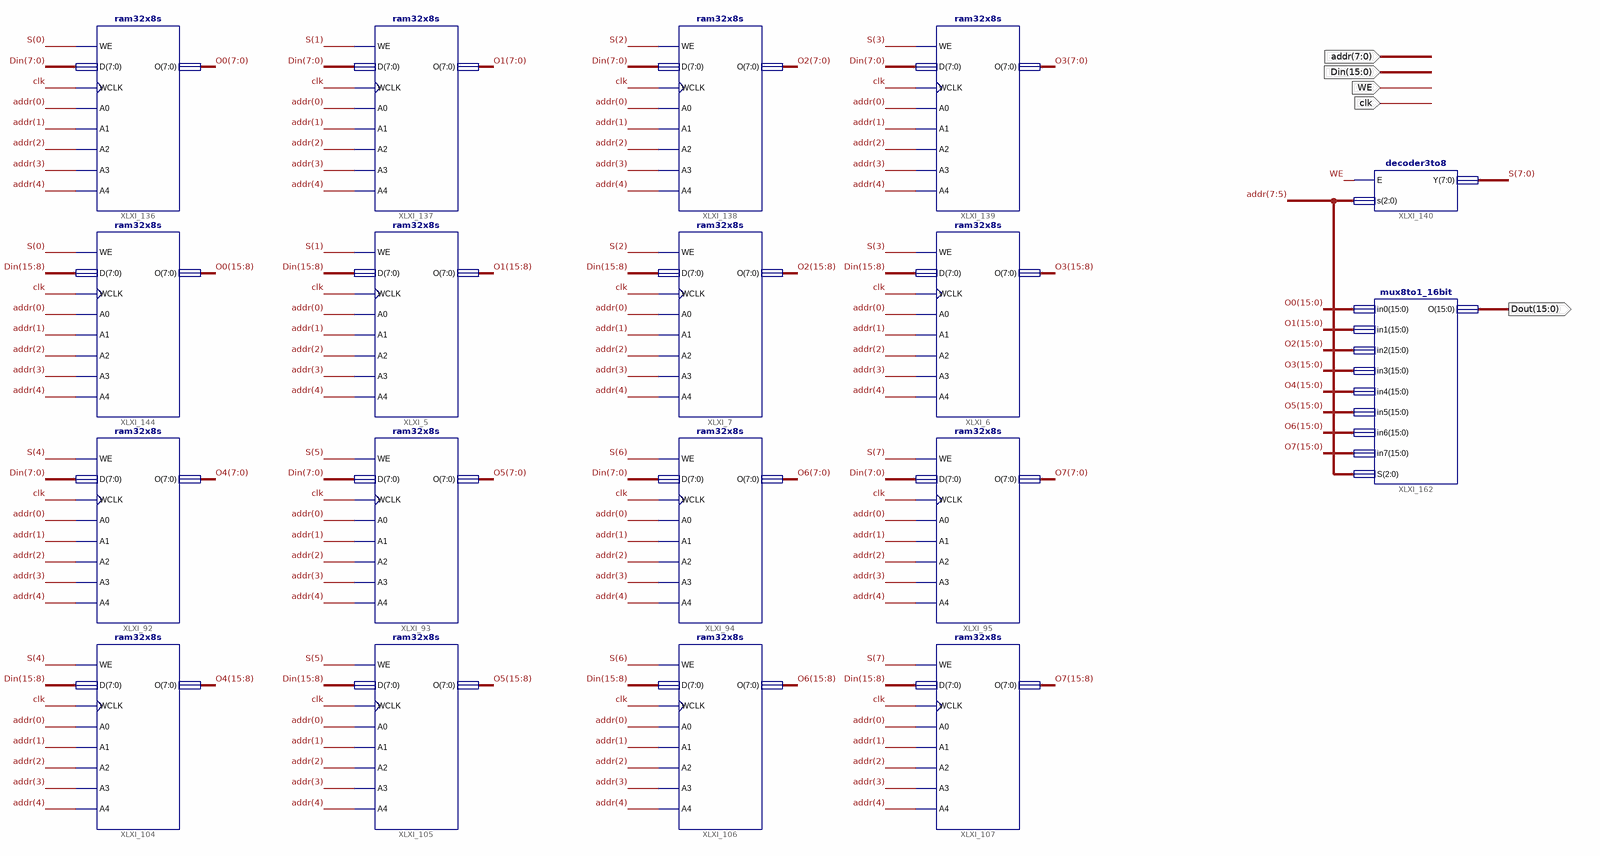
[diagram p0: schematic sheet 1]
// Xilinx ISE schematic Memory256x16.sch (spartan6) as structural Verilog: 18 symbols, 5 ports
module Memory256x16 (
  input  clk,
  input  [7:0] addr,
  input  [15:0] Din,
  input  WE,
  output [15:0] Dout
);

  wire [7:0] S;
  wire [15:0] O0, O1, O2, O3, O4, O5, O6, O7;

  decoder3to8 XLXI_140 (.E(WE), .s(addr[7:5]), .Y(S));
  ram32x8s XLXI_136 (
    .A0(addr[0]), .A1(addr[1]), .A2(addr[2]), .A3(addr[3]), .A4(addr[4]), .D(Din[7:0]), .WCLK(clk),
    .WE(S[0]), .O(O0[7:0]));
  ram32x8s XLXI_104 (
    .A0(addr[0]), .A1(addr[1]), .A2(addr[2]), .A3(addr[3]), .A4(addr[4]), .D(Din[15:8]), .WCLK(clk),
    .WE(S[4]), .O(O4[15:8]));
  ram32x8s XLXI_92 (
    .A0(addr[0]), .A1(addr[1]), .A2(addr[2]), .A3(addr[3]), .A4(addr[4]), .D(Din[7:0]), .WCLK(clk),
    .WE(S[4]), .O(O4[7:0]));
  ram32x8s XLXI_138 (
    .A0(addr[0]), .A1(addr[1]), .A2(addr[2]), .A3(addr[3]), .A4(addr[4]), .D(Din[7:0]), .WCLK(clk),
    .WE(S[2]), .O(O2[7:0]));
  ram32x8s XLXI_106 (
    .A0(addr[0]), .A1(addr[1]), .A2(addr[2]), .A3(addr[3]), .A4(addr[4]), .D(Din[15:8]), .WCLK(clk),
    .WE(S[6]), .O(O6[15:8]));
  ram32x8s XLXI_94 (
    .A0(addr[0]), .A1(addr[1]), .A2(addr[2]), .A3(addr[3]), .A4(addr[4]), .D(Din[7:0]), .WCLK(clk),
    .WE(S[6]), .O(O6[7:0]));
  ram32x8s XLXI_7 (
    .A0(addr[0]), .A1(addr[1]), .A2(addr[2]), .A3(addr[3]), .A4(addr[4]), .D(Din[15:8]), .WCLK(clk),
    .WE(S[2]), .O(O2[15:8]));
  ram32x8s XLXI_139 (
    .A0(addr[0]), .A1(addr[1]), .A2(addr[2]), .A3(addr[3]), .A4(addr[4]), .D(Din[7:0]), .WCLK(clk),
    .WE(S[3]), .O(O3[7:0]));
  ram32x8s XLXI_107 (
    .A0(addr[0]), .A1(addr[1]), .A2(addr[2]), .A3(addr[3]), .A4(addr[4]), .D(Din[15:8]), .WCLK(clk),
    .WE(S[7]), .O(O7[15:8]));
  ram32x8s XLXI_95 (
    .A0(addr[0]), .A1(addr[1]), .A2(addr[2]), .A3(addr[3]), .A4(addr[4]), .D(Din[7:0]), .WCLK(clk),
    .WE(S[7]), .O(O7[7:0]));
  ram32x8s XLXI_6 (
    .A0(addr[0]), .A1(addr[1]), .A2(addr[2]), .A3(addr[3]), .A4(addr[4]), .D(Din[15:8]), .WCLK(clk),
    .WE(S[3]), .O(O3[15:8]));
  ram32x8s XLXI_137 (
    .A0(addr[0]), .A1(addr[1]), .A2(addr[2]), .A3(addr[3]), .A4(addr[4]), .D(Din[7:0]), .WCLK(clk),
    .WE(S[1]), .O(O1[7:0]));
  ram32x8s XLXI_105 (
    .A0(addr[0]), .A1(addr[1]), .A2(addr[2]), .A3(addr[3]), .A4(addr[4]), .D(Din[15:8]), .WCLK(clk),
    .WE(S[5]), .O(O5[15:8]));
  ram32x8s XLXI_93 (
    .A0(addr[0]), .A1(addr[1]), .A2(addr[2]), .A3(addr[3]), .A4(addr[4]), .D(Din[7:0]), .WCLK(clk),
    .WE(S[5]), .O(O5[7:0]));
  ram32x8s XLXI_5 (
    .A0(addr[0]), .A1(addr[1]), .A2(addr[2]), .A3(addr[3]), .A4(addr[4]), .D(Din[15:8]), .WCLK(clk),
    .WE(S[1]), .O(O1[15:8]));
  ram32x8s XLXI_144 (
    .A0(addr[0]), .A1(addr[1]), .A2(addr[2]), .A3(addr[3]), .A4(addr[4]), .D(Din[15:8]), .WCLK(clk),
    .WE(S[0]), .O(O0[15:8]));
  mux8to1_16bit XLXI_162 (
    .in0(O0), .in1(O1), .in2(O2), .in3(O3), .in4(O4), .in5(O5), .in6(O6), .in7(O7), .S(addr[7:5]), .O(Dout));
endmodule
